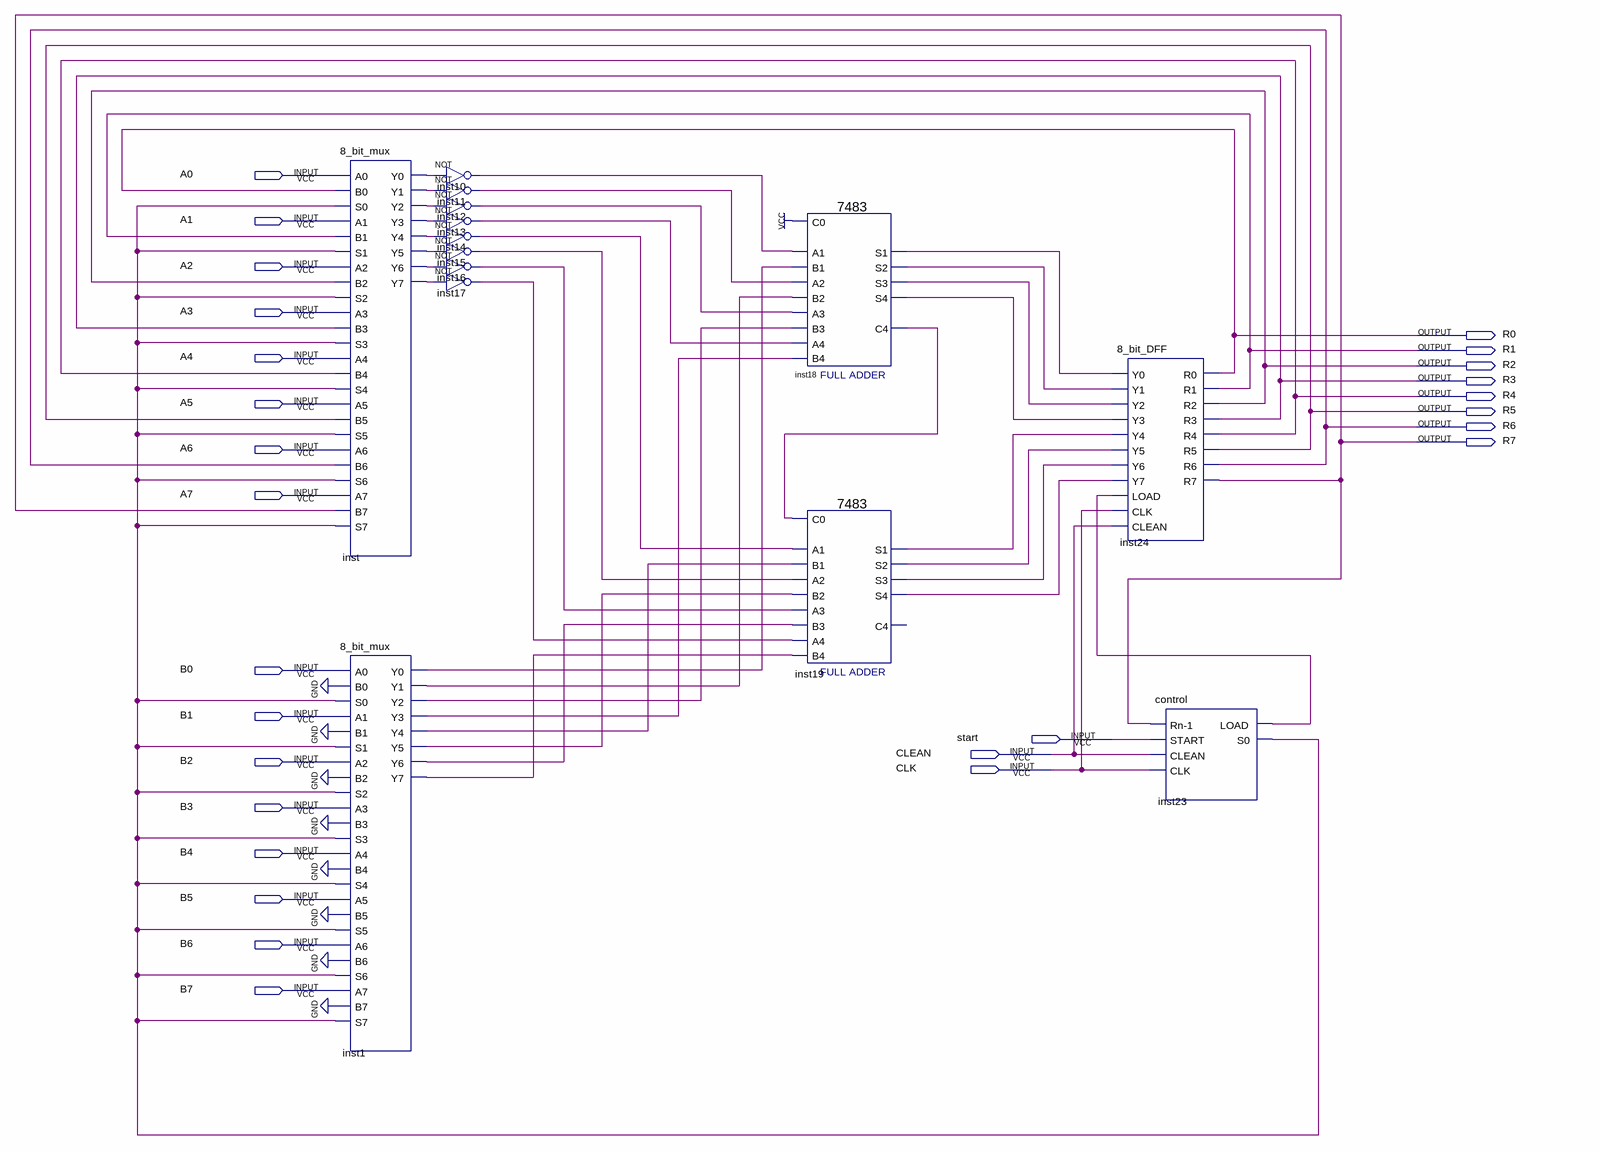
[diagram p0: schematic sheet]
// Quartus schematic LAB06.bdf as structural Verilog: 14 symbols, 27 pins
module LAB06 (
  input  A0,
  input  A1,
  input  A2,
  input  A3,
  input  A4,
  input  A5,
  input  A6,
  input  A7,
  input  B0,
  input  B1,
  input  start,
  input  CLEAN,
  input  B2,
  input  CLK,
  input  B3,
  input  B4,
  input  B5,
  input  B6,
  input  B7,
  output R0,
  output R1,
  output R2,
  output R3,
  output R4,
  output R5,
  output R6,
  output R7
);

  wire inst1_y0, inst1_y1, inst1_y2, inst1_y3, inst1_y4, inst1_y5, inst1_y6, inst1_y7, inst10_out,
       inst11_out, inst12_out, inst13_out, inst14_out, inst15_out, inst16_out, inst17_out, inst18_c4,
       inst18_s1, inst18_s2, inst18_s3, inst18_s4, inst19_s1, inst19_s2, inst19_s3, inst19_s4, inst23_load,
       inst23_s0, inst_y0, inst_y1, inst_y2, inst_y3, inst_y4, inst_y5, inst_y6, inst_y7;

  \8_bit_mux  inst (
    .A0(A0), .B0(R0), .S0(inst23_s0), .A1(A1), .B1(R1), .S1(inst23_s0), .A2(A2), .B2(R2), .S2(inst23_s0),
    .A3(A3), .B3(R3), .S3(inst23_s0), .A4(A4), .B4(R4), .S4(inst23_s0), .A5(A5), .B5(R5), .S5(inst23_s0),
    .A6(A6), .B6(R6), .S6(inst23_s0), .A7(A7), .B7(R7), .S7(inst23_s0), .Y0(inst_y0), .Y1(inst_y1),
    .Y2(inst_y2), .Y3(inst_y3), .Y4(inst_y4), .Y5(inst_y5), .Y6(inst_y6), .Y7(inst_y7));
  \8_bit_mux  inst1 (
    .A0(B0), .B0(1'b0), .S0(inst23_s0), .A1(B1), .B1(1'b0), .S1(inst23_s0), .A2(B2), .B2(1'b0),
    .S2(inst23_s0), .A3(B3), .B3(1'b0), .S3(inst23_s0), .A4(B4), .B4(1'b0), .S4(inst23_s0), .A5(B5),
    .B5(1'b0), .S5(inst23_s0), .A6(B6), .B6(1'b0), .S6(inst23_s0), .A7(B7), .B7(1'b0), .S7(inst23_s0),
    .Y0(inst1_y0), .Y1(inst1_y1), .Y2(inst1_y2), .Y3(inst1_y3), .Y4(inst1_y4), .Y5(inst1_y5), .Y6(inst1_y6),
    .Y7(inst1_y7));
  not inst10 (inst10_out, inst_y0);
  not inst11 (inst11_out, inst_y1);
  not inst12 (inst12_out, inst_y2);
  not inst13 (inst13_out, inst_y3);
  not inst14 (inst14_out, inst_y4);
  not inst15 (inst15_out, inst_y5);
  not inst16 (inst16_out, inst_y6);
  not inst17 (inst17_out, inst_y7);
  \7483  inst18 (
    .B4(inst1_y3), .C0(1'b1), .A1(inst10_out), .A2(inst11_out), .B1(inst1_y0), .B2(inst1_y1),
    .A3(inst12_out), .B3(inst1_y2), .A4(inst13_out), .S3(inst18_s3), .S4(inst18_s4), .S2(inst18_s2),
    .C4(inst18_c4), .S1(inst18_s1));
  \7483  inst19 (
    .B4(inst1_y7), .C0(inst18_c4), .A1(inst14_out), .A2(inst15_out), .B1(inst1_y4), .B2(inst1_y5),
    .A3(inst16_out), .B3(inst1_y6), .A4(inst17_out), .S3(inst19_s3), .S4(inst19_s4), .S2(inst19_s2),
    .S1(inst19_s1));  // open: C4
  \8_bit_DFF  inst24 (
    .Y0(inst18_s1), .Y1(inst18_s2), .Y2(inst18_s3), .Y3(inst18_s4), .Y4(inst19_s1), .Y5(inst19_s2),
    .Y6(inst19_s3), .Y7(inst19_s4), .LOAD(inst23_load), .CLK(CLK), .CLEAN(CLEAN), .R0(R0), .R1(R1), .R2(R2),
    .R3(R3), .R4(R4), .R5(R5), .R6(R6), .R7(R7));
  control inst23 (.\Rn-1 (R7), .START(start), .CLEAN(CLEAN), .CLK(CLK), .LOAD(inst23_load), .S0(inst23_s0));
endmodule
